# EAGLE schematic pxbee-proto (EAGLE 9.1.3)
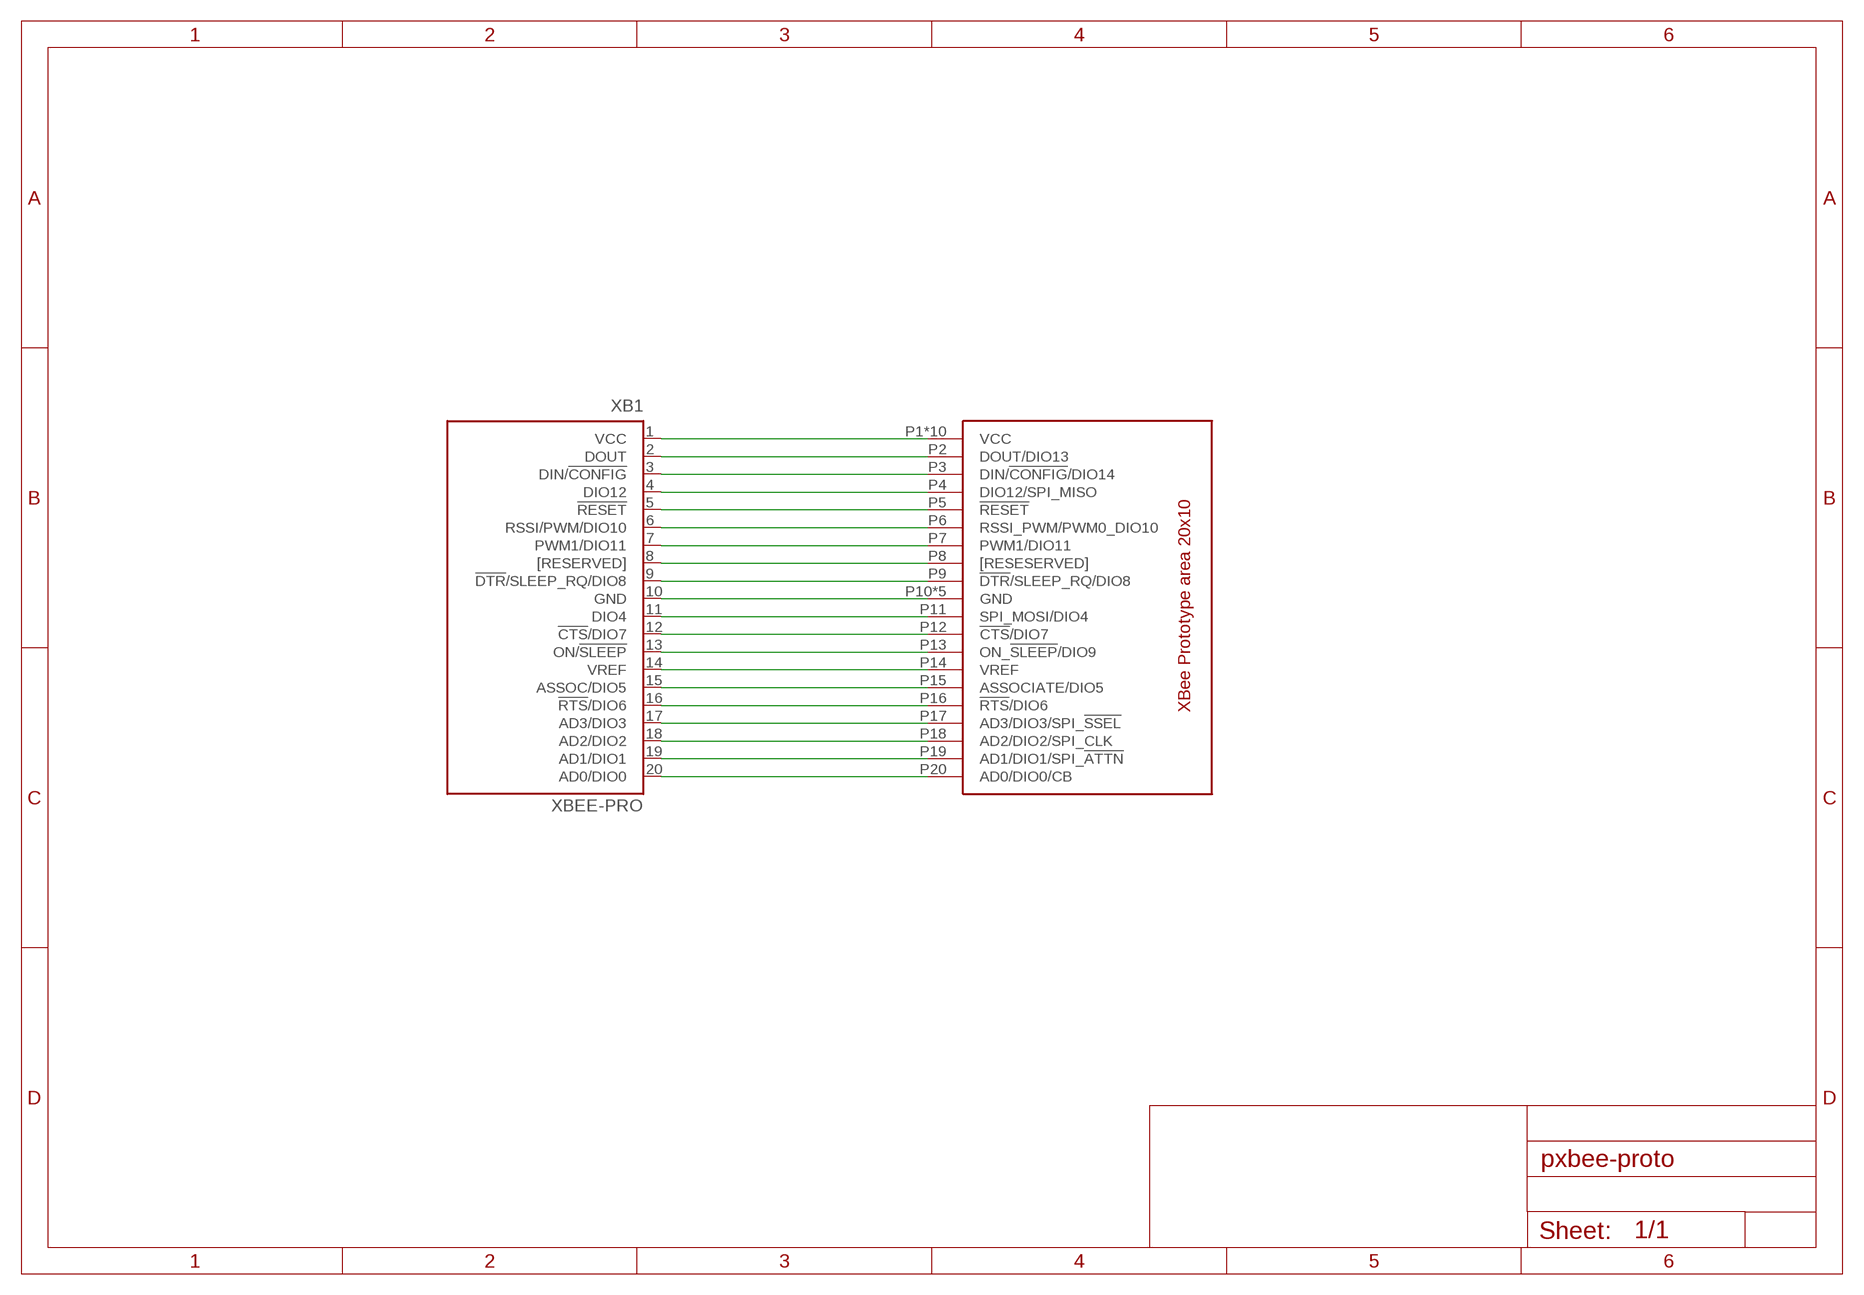
[diagram p0: schematic, sheet 1]

## Parts
U$2  XBEE_PROTO  [XBEE_PROTO_TH_20X10]
XB1  XBEE-PRO  [XBEE-PRO]

## Nets
N$1: U$2.P1(VCC) U$2.P1-B(VCC) U$2.P1-C(VCC) U$2.P1-D(VCC) U$2.P1-E(VCC) U$2.P1-F(VCC) U$2.P1-G(VCC) U$2.P1-H(VCC) U$2.P1-I(VCC) U$2.P1-J(VCC) XB1.1(VCC)
N$2: U$2.P2(DOUT/DIO13) XB1.2(DOUT)
N$3: U$2.P3(DIN/!CONFIG!/DIO14) XB1.3(DIN/!CONFIG)
N$4: U$2.P4(DIO12/SPI_MISO) XB1.4(DIO12)
N$5: U$2.P5(!RESET) XB1.5(!RESET)
N$6: U$2.P6(RSSI_PWM/PWM0_DIO10) XB1.6(RSSI/PWM/DIO10)
N$7: U$2.P7(PWM1/DIO11) XB1.7(PWM1/DIO11)
N$8: U$2.P8([RESESERVED]) XB1.8([RESERVED])
N$9: U$2.P9(!DTR!/SLEEP_RQ/DIO8) XB1.9(!DTR!/SLEEP_RQ/DIO8)
N$10: U$2.P10(GND) U$2.P10-B(GND) U$2.P10-C(GND) U$2.P10-D(GND) U$2.P10-E(GND) XB1.10(GND)
N$11: U$2.P11(SPI_MOSI/DIO4) XB1.11(DIO4)
N$12: U$2.P12(!CTS!/DIO7) XB1.12(!CTS!/DIO7)
N$13: U$2.P13(ON_!SLEEP!/DIO9) XB1.13(ON/!SLEEP)
N$14: U$2.P14(VREF) XB1.14(VREF)
N$15: U$2.P15(ASSOCIATE/DIO5) XB1.15(ASSOC/DIO5)
N$16: U$2.P16(!RTS!/DIO6) XB1.16(!RTS!/DIO6)
N$17: U$2.P17(AD3/DIO3/SPI_!SSEL!) XB1.17(AD3/DIO3)
N$18: U$2.P18(AD2/DIO2/SPI_CLK) XB1.18(AD2/DIO2)
N$19: U$2.P19(AD1/DIO1/SPI_!ATTN!) XB1.19(AD1/DIO1)
N$20: U$2.P20(AD0/DIO0/CB) XB1.20(AD0/DIO0)

## Library data of the parts
U$2 = pxbee_proto:XBEE_PROTO: XBee Prototype area
XB1 = xbee:XBEE: XBee (TM) /XBee-PRO(TM) OEM RF Modules Source: MaxStream, Inc. xbee_productmanual.pdf; MPN: XBP24-AWI-001; OC_FARNELL: 1337916; OC_NEWARK: 42M2667

## Net classes
0 default: width 0.406 mm, clearance 0.406 mm